# Altium project KIT_STM32F103C8T6.PrjPCB
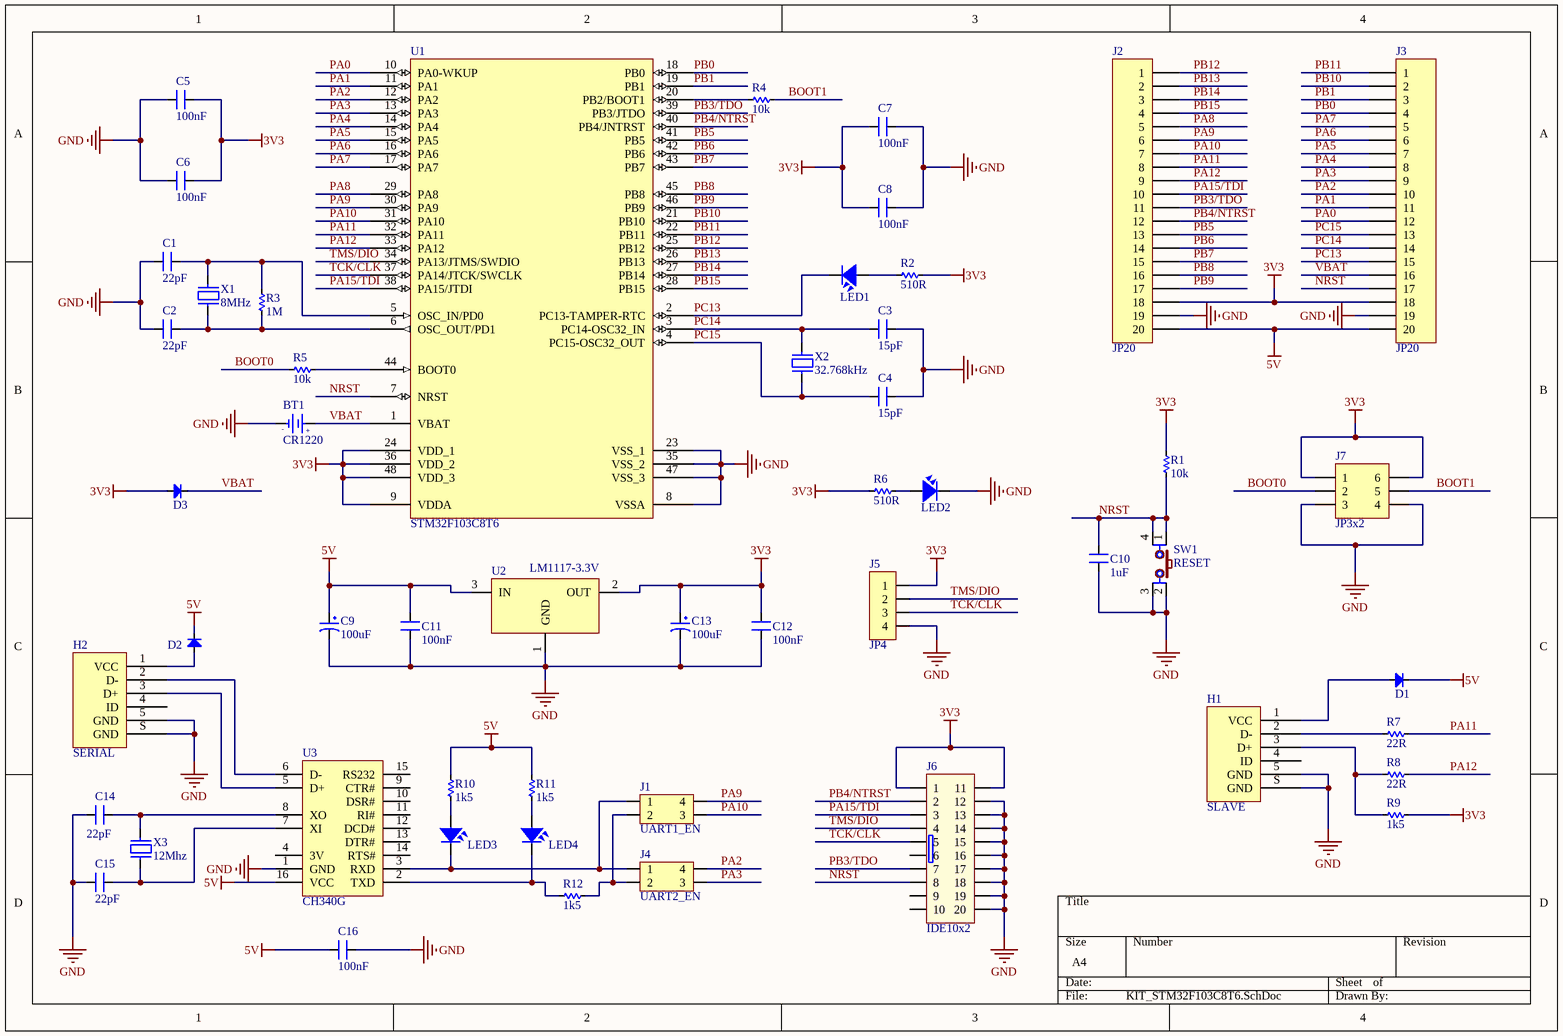
[diagram p0: KIT_STM32F103C8T6.SchDoc]
1 sheet, 52 parts. Net scope: global (net labels, ports and power ports of the same name join across sheets).
Board file: KIT_STM32F103C8T6.PcbDoc

## Sheet KIT_STM32F103C8T6.SchDoc
size A4

### Parts
BT1  CR1220  [PIN CR1220]
C1  22pF  [CN-SMD-0805]
C2  22pF  [CN-SMD-0805]
C3  15pF  [CN-SMD-0805]
C4  15pF  [CN-SMD-0805]
C5  100nF  [CN-SMD-0805]
C6  100nF  [CN-SMD-0805]
C7  100nF  [CN-SMD-0805]
C8  100nF  [CN-SMD-0805]
C9  100uF  [TU TANTALUM]
C10  1uF  [CN-SMD-0805]
C11  100nF  [CN-SMD-0805]
C12  100nF  [CN-SMD-0805]
C13  100uF  [TU TANTALUM]
C14  22pF  [CN-SMD-0805]
C15  22pF  [CN-SMD-0805]
C16  100nF  [CN-SMD-0805]
D1  T4  [DIO-SMD-106]  (value not drawn)
D2  T4  [DIO-SMD-106]  (value not drawn)
D3  T4  [DIO-SMD-106]  (value not drawn)
H1  SLAVE  [MINI USB]
H2  SERIAL  [MINI USB]
J1  UART1_EN  [JP2-D2T]
J2  JP20  [JP20-D1T]
J3  JP20  [JP20-D1T]
J4  UART2_EN  [JP2-D2T]
J5  JP4  [JP4-D1T]
J6  IDE10x2  [IDC20]
J7  JP3x2  [JP3-D2T]
LED1  L  [LED-0805-Green]  (value not drawn)
LED2  PWR  [LED-0805-Green]  (value not drawn)
LED3  R  [LED-0805-Green]  (value not drawn)
LED4  T  [LED-0805-Green]  (value not drawn)
R1  10k  [RES-SMD-0805]
R2  510R  [RES-SMD-0805]
R3  1M  [RES-SMD-0805]
R4  10k  [RES-SMD-0805]
R5  10k  [RES-SMD-0805]
R6  510R  [RES-SMD-0805]
R7  22R  [RES-SMD-0805]
R8  22R  [RES-SMD-0805]
R9  1k5  [RES-SMD-0805]
R10  1k5  [RES-SMD-0805]
R11  1k5  [RES-SMD-0805]
R12  1k5  [RES-SMD-0805]
SW1  RESET  [SW2-SMD]
U1  STM32F103C8T6  [LQFP48]
U2  LM1117-3.3V  [SOT223]
U3  CH340G  [SO16]
X1  8MHz  [XT2]
X2  32.768kHz  [XT32k]
X3  12Mhz  [XT2]

### Nets
3V3: C5.2 C6.2 C7.2 C8.2 C12.1 C13.1 D3.1(A) J2.18 J3.18 J5.1 J6.1 J6.11 J7.1 J7.6 R1.1 R2.1 R6.2 R9.1 U1.9(VDDA) U1.24(VDD_1) U1.36(VDD_2) U1.48(VDD_3) U2.2(OUT)
5V: C9.1 C11.1 C16.2 D1.2(K) D2.2(K) J2.20 J3.20 R10.1 R11.1 U2.3(IN) U3.16(VCC)
GND: BT1.2(GND) C1.1 C2.1 C3.2 C4.2 C5.1 C6.1 C7.1 C8.1 C9.2 C10.1 C11.2 C12.2 C13.2 C14.2 C15.2 C16.1 H1.5(GND) H1.S(GND) H2.5(GND) H2.S(GND) J2.19 J3.19 J5.4 J6.12 J6.13 J6.14 J6.15 J6.16 J6.17 J6.18 J6.19 J6.20 J7.3 J7.4 LED2.2 SW1.2 SW1.3 U1.8(VSSA) U1.23(VSS_1) U1.35(VSS_2) U1.47(VSS_3) U2.1(GND) U3.1(GND)
BOOT0: J7.2 R5.2
BOOT1: J7.5 R4.1
NRST: C10.2 J3.17 J6.8 R1.2 SW1.1 SW1.4 U1.7(NRST)
PA0: J3.12 U1.10(PA0-WKUP)
PA1: J3.11 U1.11(PA1)
PA2: J3.10 J4.4 U1.12(PA2)
PA3: J3.9 J4.3 U1.13(PA3)
PA4: J3.8 U1.14(PA4)
PA5: J3.7 U1.15(PA5)
PA6: J3.6 U1.16(PA6)
PA7: J3.5 U1.17(PA7)
PA8: J2.5 U1.29(PA8)
PA9: J1.4 J2.6 U1.30(PA9)
PA10: J1.3 J2.7 U1.31(PA10)
PA11: J2.8 R7.1 U1.32(PA11)
PA12: J2.9 R8.1 U1.33(PA12)
PA15/TDI: J2.10 J6.3 U1.38(PA15/JTDI)
PB0: J3.4 U1.18(PB0)
PB1: J3.3 U1.19(PB1)
PB3/TDO: J2.11 J6.7 U1.39(PB3/JTDO)
PB4/NTRST: J2.12 J6.2 U1.40(PB4/JNTRST)
PB5: J2.13 U1.41(PB5)
PB6: J2.14 U1.42(PB6)
PB7: J2.15 U1.43(PB7)
PB8: J2.16 U1.45(PB8)
PB9: J2.17 U1.46(PB9)
PB10: J3.2 U1.21(PB10)
PB11: J3.1 U1.22(PB11)
PB12: J2.1 U1.25(PB12)
PB13: J2.2 U1.26(PB13)
PB14: J2.3 U1.27(PB14)
PB15: J2.4 U1.28(PB15)
PC13: J3.15 LED1.2 U1.2(PC13-TAMPER-RTC)
PC14: C3.1 J3.14 U1.3(PC14-OSC32_IN) X2.2
PC15: C4.1 J3.13 U1.4(PC15-OSC32_OUT) X2.1
TCK/CLK: J5.3 J6.5 U1.37(PA14/JTCK/SWCLK)
TMS/DIO: J5.2 J6.4 U1.34(PA13/JTMS/SWDIO)
VBAT: BT1.1(+3V) D3.2(K) J3.16 U1.1(VBAT)
NetC1_2: C1.2 R3.1 U1.5(OSC_IN/PD0) X1.2
NetC2_2: C2.2 R3.2 U1.6(OSC_OUT/PD1) X1.1
NetC14_1: C14.1 U3.8(XO) X3.2
NetC15_1: C15.1 U3.7(XI) X3.1
NetD1_1: D1.1(A) H1.1(VCC)
NetD2_1: D2.1(A) H2.1(VCC)
NetH1_2: H1.2(D-) R7.2
NetH1_3: H1.3(D+) R8.2 R9.2
NetH2_2: H2.2(D-) U3.6(D-)
NetH2_3: H2.3(D+) U3.5(D+)
NetJ1_1: J1.1 J4.1 LED3.2 U3.3(RXD)
NetJ1_2: J1.2 J4.2 R12.1
NetLED1_1: LED1.1 R2.2
NetLED2_1: LED2.1 R6.1
NetLED3_1: LED3.1 R10.2
NetLED4_1: LED4.1 R11.2
NetLED4_2: LED4.2 R12.2 U3.2(TXD)
NetR4_2: R4.2 U1.20(PB2/BOOT1)
NetR5_1: R5.1 U1.44(BOOT0)

Not connected (* = marked no-connect by the designer): H1 4(ID); H2 4(ID); J6 6 9 10; U3 4(3V) 9(CTR#) 10(DSR#) 11(RI#) 12(DCD#) 13(DTR#) 14(RTS#) 15(RS232)

### Notes on the sheet
- (in symbol PIN CR1220) -; +

### Library data of the parts
BT1 = PIN CR1220
C1-C8 C10-C12 C14-C16 = CN: Value: 33pF
C9 C13 = CAP TANTALUM
D1-D3 = Diode SMD: Default Diode; Code - JEDEC: DO-214-AB; Value: 1N5007; Published: 8-Jun-2000; Revision: July-2002: Re-released for DXP Platform.; Publisher: Altium Limited
H1 H2 = MINI USB
J1 J4 = JP2x2: WR-PHD 2.54 mm Dual Socket Header; Manufacturer: W¨¹rth Elektronik eiSos GmbH; partNo: 61300421821; ComponentLink1 Description: Manufacturer; ComponentLink2 Description: Datasheet; NoPins: 04; Created Date: 29 March 2013; ComponentLink1URL: http://www.we-online.com; ComponentLink2URL: http://katalog.we-online.de/em/datasheet/6130xx21821.pdf; Created by: Karrer Zheng
J2 J3 = JP20: WR-PHD 2.54 mm Angled Socket Header; Manufacturer: W¨¹rth Elektronik eiSos GmbH; partNo: 613020143121; ComponentLink1 Description: Manufacturer; ComponentLink2 Description: Datasheet; NoPins: 20; Created Date: 29 March 2013; ComponentLink1URL: http://www.we-online.com; ComponentLink2URL: http://katalog.we-online.de/em/datasheet/6130xx143121.pdf; Created by: Karrer Zheng
J5 = JP4: WR-PHD 2.54 mm Angled Socket Header; Manufacturer: W¨¹rth Elektronik eiSos GmbH; partNo: 613004143121; ComponentLink1 Description: Manufacturer; ComponentLink2 Description: Datasheet; NoPins: 04; Created Date: 29 March 2013; ComponentLink1URL: http://www.we-online.com; ComponentLink2URL: http://katalog.we-online.de/em/datasheet/6130xx143121.pdf; Created by: Karrer Zheng
J6 = IDC 10X2: Value: Header 5x2
J7 = JP3x2: WR-PHD 2.54 mm Dual Socket Header; Manufacturer: W¨¹rth Elektronik eiSos GmbH; partNo: 61300621821; ComponentLink1 Description: Manufacturer; ComponentLink2 Description: Datasheet; NoPins: 06; Created Date: 29 March 2013; ComponentLink1URL: http://www.we-online.com; ComponentLink2URL: http://katalog.we-online.de/em/datasheet/6130xx21821.pdf; Created by: Karrer Zheng
LED1-LED4 = LED SMD: Value: LED 3 - 5 ly 2 Colour
R1-R12 = Res-SMD: Resistor; Manufacturer: Generic Components; Class: Passive; Published: 08/06/2000; Publisher: Altium Hobart Technology Centre
SW1 = SW4: Switch button 4 pin; Value: Button chip 4 pin
U2 = LM1117: 800mA Low-Dropout Linear Regulator; Creator: Nguyen Ba Bien; Website: http://group3i.net
U3 = CH340G: High and Low Side Driver; Note: Pins 4, 8 and 14 are not connected; Published: 8-Jun-2000; LatestRevisionDate: 04-Mar-2005; LatestRevisionNote: Stylized 3D Model Added.; DatasheetVersion: PD60147J; PackageReference: PDIP14; Publisher: Altium Limited; PackageDescription: DIP; 14 Leads; Row Spacing 7.62 mm; Pitch 2.54 mm; ComponentLink1Description: Manufacturer Link; ComponentLink1URL: http://www.irf.com/; ComponentLink2Description: Datasheet; ComponentLink2URL: http://www.irf.com/product-info/datasheets/data/ir2110.pdf
X1-X3 = XT2: Crystal, 32.768 KHz, -40 to 85 degC, 3.2 x 1.5 x 0.9 mm SMD; Value: 4Mhz